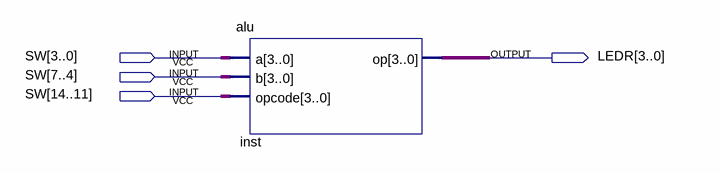
[diagram p0: schematic sheet]
// Quartus schematic blockdiagram.bdf as structural Verilog: 1 symbols, 4 pins
module blockdiagram (
  input  [14:0] SW,
  output [3:0] LEDR
);

  alu inst (.a(SW[3:0]), .b(SW[7:4]), .opcode(SW[14:11]), .op(LEDR));
endmodule
